# EAGLE design Yayın Ders 2 (EAGLE 9.6.2)
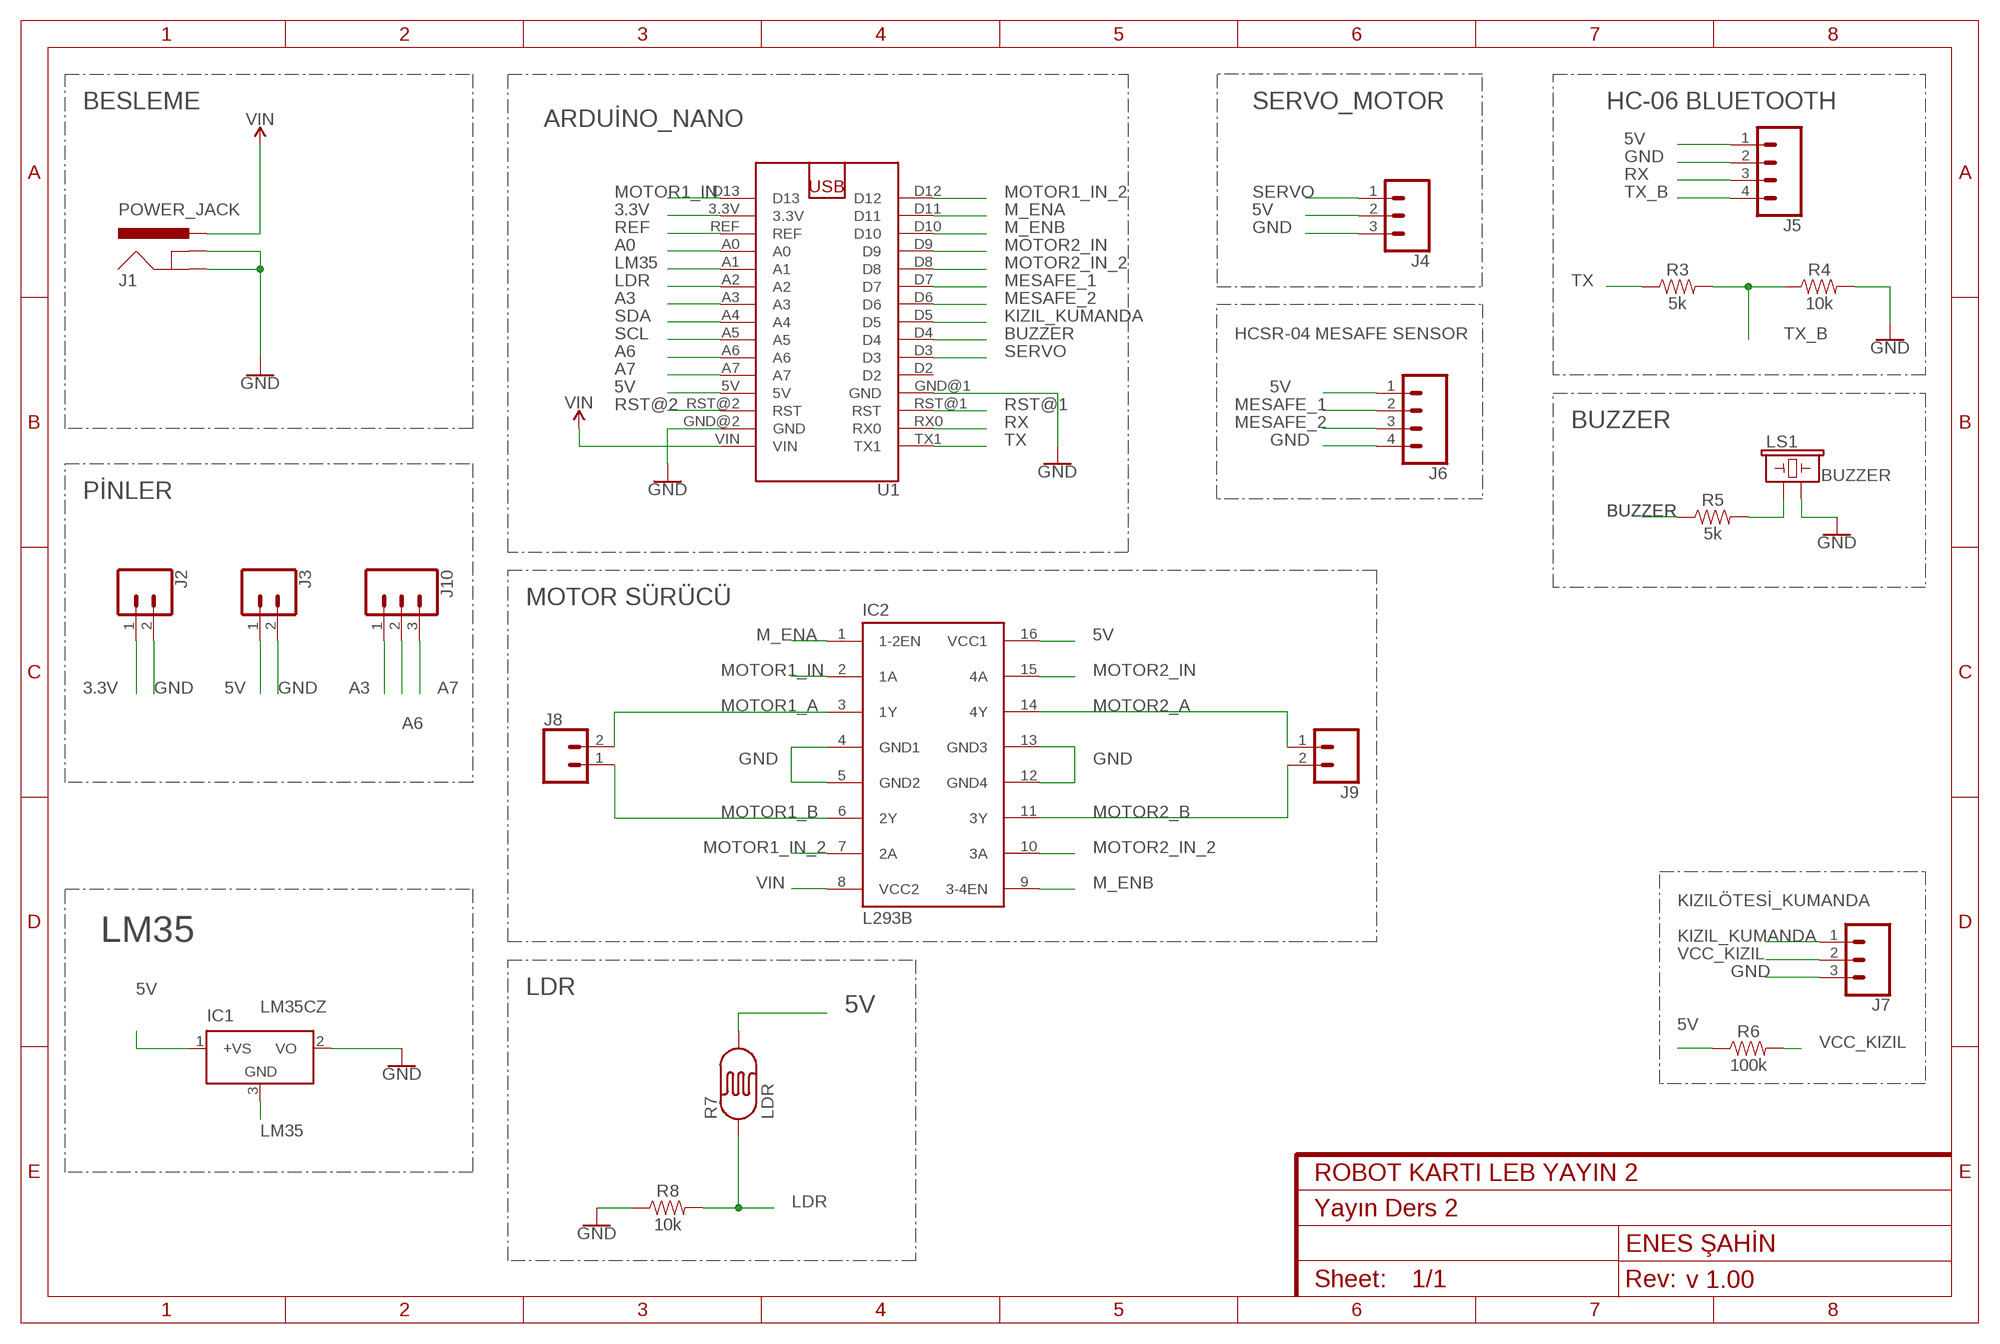
[diagram p0: schematic, sheet 1]
FRAME1 (FRAME-A4L): CNAME: ROBOT KARTI LEB YAYIN 2; CREVISION: v 1.00; DESIGNER: ENES ŞAHİN

## Parts
IC1  LM35CZ  [TO92]
IC2  L293B  L293D  [DIL16]
J1  POWER_JACK  [POWER_JACK_PTH]
J2  CONN_02  [1X02]
J3  CONN_02  [1X02]
J4  CONN_03  [1X03]
J5  CONN_04  [1X04]
J6  CONN_04  [1X04]
J7  CONN_03  [1X03]
J8  CONN_02  [1X02]
J9  CONN_02  [1X02]
J10  CONN_03  [1X03]
LS1  BUZZER  BUZZER-PTH  [BUZZER-12MM]
R3  5k  1KOHM-HORIZ-1/4W-1%  [AXIAL-0.3]
R4  10k  1KOHM-HORIZ-1/4W-1%  [AXIAL-0.3]
R5  5k  1KOHM-HORIZ-1/4W-1%  [AXIAL-0.3]
R6  100k  1KOHM-HORIZ-1/4W-1%  [AXIAL-0.3]
R7  LDR  PHOTOCELLPTH  [PHOTOCELL]
R8  10k  1KOHM-HORIZ-1/4W-1%  [AXIAL-0.3]
U1  ARDUINO_NANO  [ARDUINO_NANO]

## Nets
3.3V: J2.1 U1.3.3V
5V: IC1.1(+VS) IC2.16(VCC1) J3.1 J4.2 J5.1 J6.1 R6.P$1 R7.2 U1.5V
A0: U1.A0
A3: J10.1 U1.A3
A6: J10.2 U1.A6
A7: J10.3 U1.A7
BUZZER: R5.P$1 U1.D4
GND: IC1.2(VO) IC2.4(GND1) IC2.5(GND2) IC2.12(GND4) IC2.13(GND3) J1.GND J1.GNDBREAK J2.2 J3.2 J4.3 J5.2 J6.4 J7.3 LS1.- R4.P$2 R8.P$1 U1.GND@1(GND) U1.GND@2(GND)
KIZIL_KUMANDA: J7.1 U1.D5
LDR: R7.1 R8.P$2 U1.A2
LM35: IC1.3(GND) U1.A1
M_ENA: IC2.1(1-2EN) U1.D11
M_ENB: IC2.9(3-4EN) U1.D10
MESAFE_1: J6.2 U1.D7
MESAFE_2: J6.3 U1.D6
MOTOR1_A: IC2.3(1Y) J8.2
MOTOR1_B: IC2.6(2Y) J8.1
MOTOR1_IN: IC2.2(1A) U1.D13
MOTOR1_IN_2: IC2.7(2A) U1.D12
MOTOR2_A: IC2.14(4Y) J9.1
MOTOR2_B: IC2.11(3Y) J9.2
MOTOR2_IN: IC2.15(4A) U1.D9
MOTOR2_IN_2: IC2.10(3A) U1.D8
N$1: LS1.+ R5.P$2
REF: U1.REF
RST@1: U1.RST@1(RST)
RST@2: U1.RST@2(RST)
RX: J5.3 U1.RX0
SCL: U1.A5
SDA: U1.A4
SERVO: J4.1 U1.D3
TX: R3.P$1 U1.TX1
TX_B: J5.4 R3.P$2 R4.P$1
VCC_KIZIL: J7.2 R6.P$2
VIN: IC2.8(VCC2) J1.PWR U1.VIN
Unconnected: U1.D2

## Notes on the sheet
- BESLEME | SERVO_MOTOR | HC-06 BLUETOOTH
- ARDUİNO_NANO
- HCSR-04 MESAFE SENSOR
- BUZZER
- PİNLER
- MOTOR SÜRÜCÜ
- KIZILÖTESİ_KUMANDA
- LM35
- LDR

## Library data of the parts
IC1 = lm35:LM35: Single-Supply Centigrade Temperature Sensor Vout = (10mV/°C x Temp °C) +5mmmV Source: http://www.national.com/ds/LM/LM35.pdf
IC2 = st-microelectronics:L293D: PUSH-PULL 4 CHANNEL DRIVER; MPN: L293D; OC_FARNELL: 9589619; OC_NEWARK: 56P8249
J1 = SparkFun-Connectors:POWER_JACK: Power Jack Connector This is the standard 5.5mm barrel jack for power. The PTH is the most common, proven, reliable, footprint. The Slot footprint only works if the mill layer is transmitted to the PCB fab house so be warned. Here are the connectors we sell at SparkFun: DC Barrel Power Jack/Connector <https://www.sparkfun.com/products/119> (PRT-00119) DC Barrel Power Jack/Connector (SMD) <https://www.sparkfun.com/products/12748> (PRT-12748) DC Barrel Jack Adapter - Breadboard Compatible <https://www.sparkfun.com/products/10811> (PRT-10811) It is used on this SparkFun product (and many, many others): SparkFun RedBoard - Programmed with Arduino <https://www.sparkfun.com/products/12757> (DEV-12757) Also, if you need a mating power supply or connector, please check these out: Wall Adapter Power Supply - 9VDC 650mA <https://www.sparkfun.com/products/298> (TOL-00298) DC Barrel Jack Adapter - Male <https://www.sparkfun.com/products/10287> (PRT-10287); PROD_ID: CONN-08197
J2 J3 J8 J9 = SparkFun-Connectors:CONN_02: Multi connection point. Often used as Generic Header-pin footprint for 0.1 inch spaced/style header connections On any of the 0.1 inch spaced packages, you can populate with these: Break Away Headers - Straight <https://www.sparkfun.com/products/116> (PRT-00116) Break Away Male Headers - Right Angle <https://www.sparkfun.com/products/553> (PRT-00553) Female Headers <https://www.sparkfun.com/products/115> (PRT-00115) Break Away Headers - Machine Pin <https://www.sparkfun.com/products/117> (PRT-00117) Break Away Female Headers - Swiss Machine Pin <https://www.sparkfun.com/products/743> (PRT-00743) For SCREWTERMINALS and SPRING TERMINALS visit here: Screw Terimnals on SparkFun.com <https://www.sparkfun.com/search/results?term=Screw+Terminals> (5mm/3.5mm/2.54mm spacing) This device is also useful as a general connection point to wire up your design to another part of your project. Our various solder wires solder well into these plated through hole pads. Hook-Up Wire - Assortment (Stranded, 22 AWG) <https://www.sparkfun.com/products/11375> (PRT-11375) Hook-Up Wire - Assortment (Solid Core, 22 AWG) <https://www.sparkfun.com/products/11367> (PRT-11367) View the entire wire category on our website here <https://www.sparkfun.com/categories/141> Special notes: Molex polarized connector foot print use with: PRT-08233 with associated crimp pins and housings. 2.54_SCREWTERM for use with PRT-10571. 3.5mm Screw Terminal footprints for PRT-08084 5mm Screw Terminal footprints for use with PRT-08432
J4 J7 J10 = SparkFun-Connectors:CONN_03: Multi connection point. Often used as Generic Header-pin footprint for 0.1 inch spaced/style header connections On any of the 0.1 inch spaced packages, you can populate with these: Break Away Headers - Straight <https://www.sparkfun.com/products/116> (PRT-00116) Break Away Male Headers - Right Angle <https://www.sparkfun.com/products/553> (PRT-00553) Female Headers <https://www.sparkfun.com/products/115> (PRT-00115) Break Away Headers - Machine Pin <https://www.sparkfun.com/products/117> (PRT-00117) Break Away Female Headers - Swiss Machine Pin <https://www.sparkfun.com/products/743> (PRT-00743) Stackable Header - 3 Pin (Female, 0.1") <https://www.sparkfun.com/products/13875> (PRT-13875) For SCREWTERMINALS and SPRING TERMINALS visit here: Screw Terimnals on SparkFun.com <https://www.sparkfun.com/search/results?term=Screw+Terminals> (5mm/3.5mm/2.54mm spacing) This device is also useful as a general connection point to wire up your design to another part of your project. Our various solder wires solder well into these plated through hole pads. Hook-Up Wire - Assortment (Stranded, 22 AWG) <https://www.sparkfun.com/products/11375> (PRT-11375) Hook-Up Wire - Assortment (Solid Core, 22 AWG) <https://www.sparkfun.com/products/11367> (PRT-11367) View the entire wire category on our website here <https://www.sparkfun.com/categories/141> Special notes: Molex polarized connector foot print use with SKU : PRT-08232 with associated crimp pins and housings.
J5 J6 = SparkFun-Connectors:CONN_04: Multi connection point. Often used as Generic Header-pin footprint for 0.1 inch spaced/style header connections On any of the 0.1 inch spaced packages, you can populate with these: Break Away Headers - Straight <https://www.sparkfun.com/products/116> (PRT-00116) Break Away Male Headers - Right Angle <https://www.sparkfun.com/products/553> (PRT-00553) Female Headers <https://www.sparkfun.com/products/115> (PRT-00115) Break Away Headers - Machine Pin <https://www.sparkfun.com/products/117> (PRT-00117) Break Away Female Headers - Swiss Machine Pin <https://www.sparkfun.com/products/743> (PRT-00743) For SCREWTERMINALS and SPRING TERMINALS visit here: Screw Terimnals on SparkFun.com <https://www.sparkfun.com/search/results?term=Screw+Terminals> (5mm/3.5mm/2.54mm spacing) This device is also useful as a general connection point to wire up your design to another part of your project. Our various solder wires solder well into these plated through hole pads. Hook-Up Wire - Assortment (Stranded, 22 AWG) <https://www.sparkfun.com/products/11375> (PRT-11375) Hook-Up Wire - Assortment (Solid Core, 22 AWG) <https://www.sparkfun.com/products/11367> (PRT-11367) View the entire wire category on our website here <https://www.sparkfun.com/categories/141> Special notes: Molex polarized connector foot print use with SKU : PRT-08231 with associated crimp pins and housings. 1MM SMD Version SKU: PRT-10208; PROD_ID: CONN-09696
LS1 = SparkFun-Electromechanical:BUZZER: Buzzer Small round buzzers that operate around the audible 2kHz range. You can use these as speakers to create simple music or user interfaces. Variant Overview: PTH - Mini Speaker - PC Mount 12mm 2.048kHz <https://www.sparkfun.com/products/7950> PTH_KIT - Mini Speaker - PC Mount 12mm 2.048kHz <https://www.sparkfun.com/products/7950> KIT simplifies soldering by adding stop mask to one side of the pads. PTH_NO_SILK - Mini Speaker - PC Mount 12mm 2.048kHz <https://www.sparkfun.com/products/7950> No silkscreen indicator of buzzer outline. PTH_KIT_NO_SILK - Mini Speaker - PC Mount 12mm 2.048kHz <https://www.sparkfun.com/products/7950> KIT package w/o silkscreen SMD - Buzzer Audio Magnetic (CCV-084B16) SMD buzzer used on, e.g. the LilyPad Buzzer <https://www.sparkfun.com/products/8463> and RFID USB Reader <https://www.sparkfun.com/products/9963>. SMD_KIT - Buzzer Audio Magnetic (CCV-084B16) SMD Buzzer with elongated pins to make soldering easier. Used on the SparkFun Simon Says - Surface Mount Soldering Kit <https://www.sparkfun.com/products/10935>.; PROD_ID: COMP-08253; SF_SKU: COM-07950
R3-R5 = SparkFun-Resistors:1KOHM: 1kΩ resistor A resistor is a passive two-terminal electrical component that implements electrical resistance as a circuit element. Resistors act to reduce current flow, and, at the same time, act to lower voltage levels within circuits. - Wikipedia; PROD_ID: RES-12182; VALUE: 1k
R6 R8 = SparkFun-Resistors1:1KOHM: 1kΩ resistor A resistor is a passive two-terminal electrical component that implements electrical resistance as a circuit element. Resistors act to reduce current flow, and, at the same time, act to lower voltage levels within circuits. - Wikipedia; PROD_ID: RES-12182; VALUE: 1k
R7 = SparkFun:PHOTOCELL: Photocell Also known as a CdS photoresistor. This is a low cost way to detect light levels. Resistance decreases with more incoming light. SparkFun SKU: SEN-09088
U1 = LezzetliRobotTrifleri:ARDUINO_NANO: ARDUİNO NANO DEVİCE

## Board
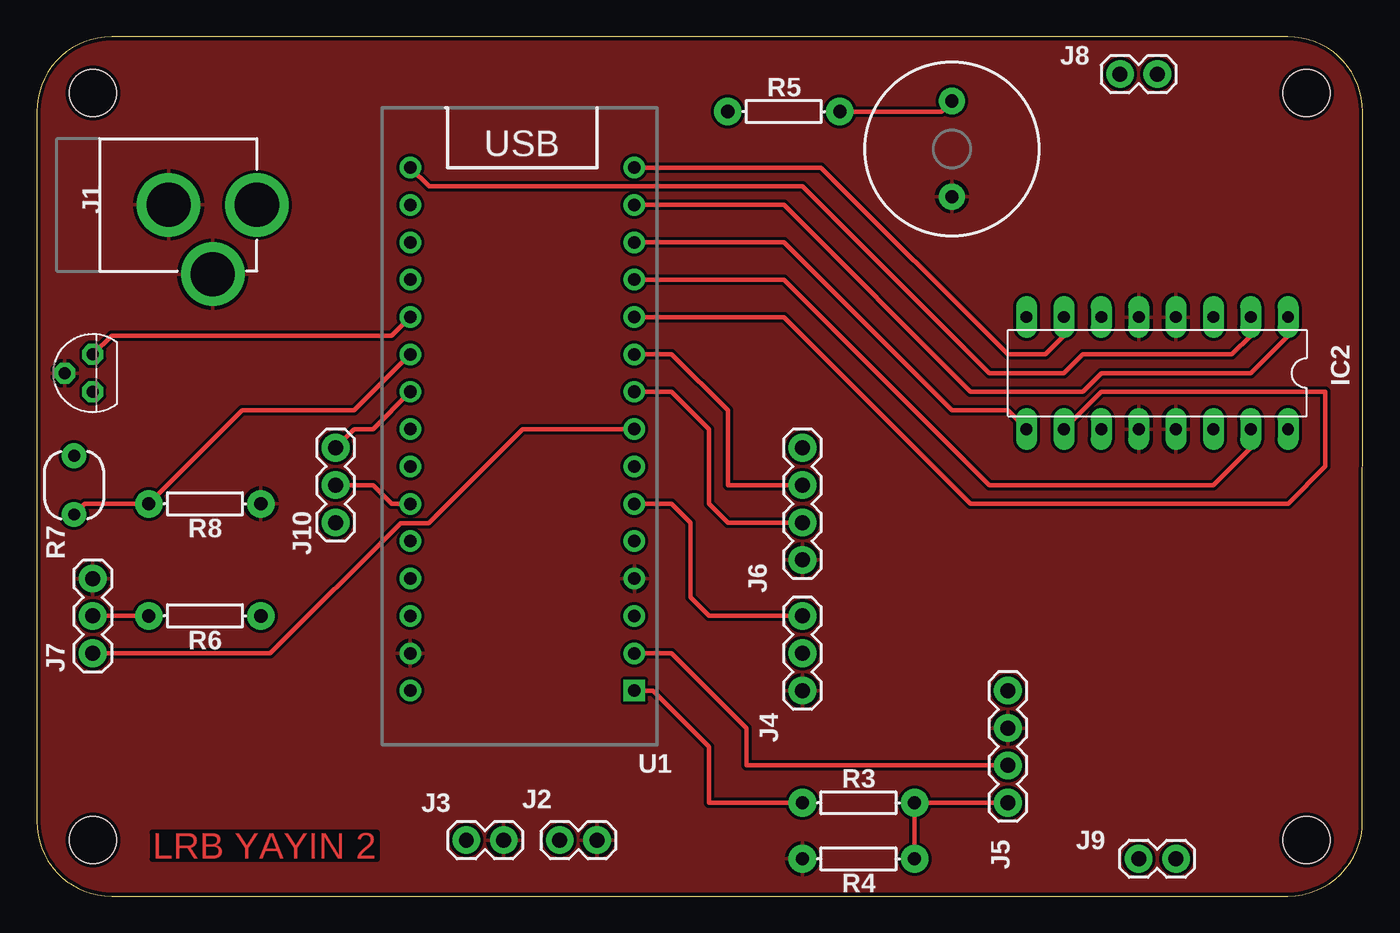
[diagram p1: board, top side]
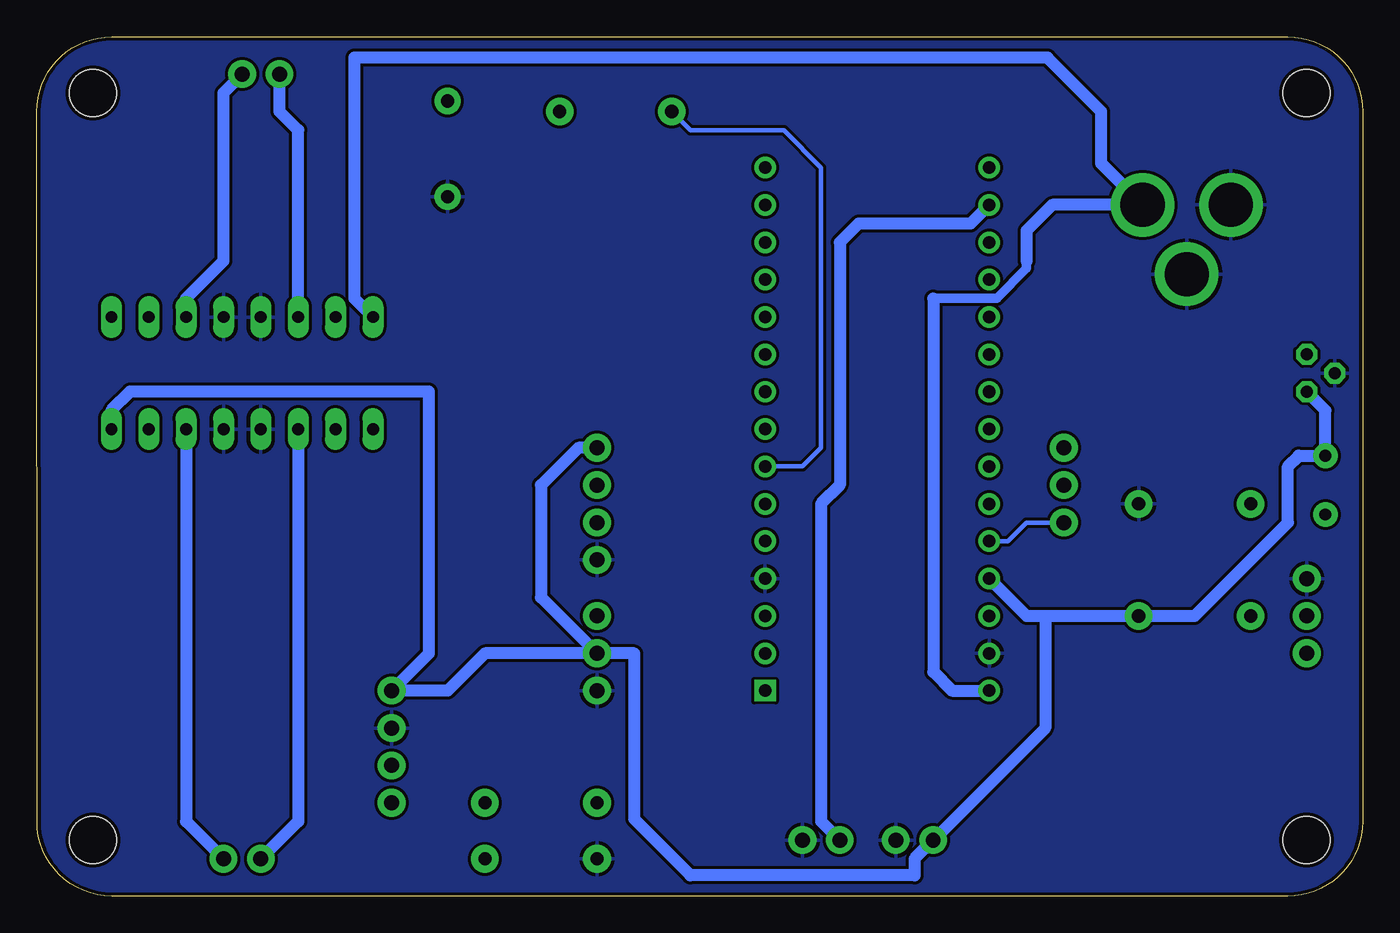
[diagram p2: board, bottom side, seen from below]

Size 90.17 x 58.42 mm. Coordinates in mm from the lower left corner, seen from the top.
Outline: 0,53.34 0,5.08 arc90 5.08,0 85.07,0 arc90 90.15,5.08 90.17,53.34 arc90 85.09,58.42 5.08,58.42 arc90 0,53.34
Copper layers (1*16): Top 0.035mm / dielectric 1.5mm / Bottom 0.035mm
Design rules "SparkFun": minimum track width 8mil, minimum drill 20mil, track to track 8mil, track to pad 8mil, pad to pad 8mil, via to via 8mil, smd to smd 8mil, copper to edge 10mil, drill to drill 8mil, minimum pad ring 12mil, minimum via ring 10mil, stop-mask expansion 4mil, vias tented up to drill 25mil, thermal gap 10mil
Holes 3.2 mm at 3.81,54.61 86.36,54.61 86.36,3.81 3.81,3.81

### Footprints (pad centres in the part's own frame; a part is rotated, then mirrored left to right if it is on the bottom)
TO92 = drill 0.813 octagon: 1 -1.27,0; 2 0,1.905; 3 1.27,0
DIL16 = drill 0.813 long: 1 -8.89,-3.81; 2 -6.35,-3.81; 3 -3.81,-3.81; 4 -1.27,-3.81; 5 1.27,-3.81; 6 3.81,-3.81; 7 6.35,-3.81; 8 8.89,-3.81; 9 8.89,3.81; 10 6.35,3.81; 11 3.81,3.81; 12 1.27,3.81; 13 -1.27,3.81; 14 -3.81,3.81; 15 -6.35,3.81; 16 -8.89,3.81
POWER_JACK_PTH = drill 2.997 pad 4.318: GND 0,7.7; GNDBREAK 4.7,10.7; PWR 0,13.7
1X02 = drill 1.016 pad 1.88: 1 0,0; 2 2.54,0
1X03 = drill 1.016 pad 1.88: 1 0,0; 2 2.54,0; 3 5.08,0
1X04 = drill 1.016 pad 1.88: 1 0,0; 2 2.54,0; 3 5.08,0; 4 7.62,0
BUZZER-12MM = drill 0.9 pad 1.778: + 3.25,0; - -3.25,0
AXIAL-0.3 = drill 0.9 pad 1.88: P$1 -3.81,0; P$2 3.81,0
PHOTOCELL = drill 0.8 pad 1.676: 1 -2,0; 2 2,0
ARDUINO_NANO = drill 0.85: 3.3V 15.24,2.54; 5V 15.24,27.94; A0 15.24,7.62; A1 15.24,10.16; A2 15.24,12.7; A3 15.24,15.24; A4 15.24,17.78; A5 15.24,20.32; A6 15.24,22.86; A7 15.24,25.4; D2 0,25.4; D3 0,22.86; D4 0,20.32; D5 0,17.78; D6 0,15.24; D7 0,12.7; D8 0,10.16; D9 0,7.62; D10 0,5.08; D11 0,2.54; D12 0,0; D13 15.24,0; GND@1 0,27.94; GND@2 15.24,33.02; REF 15.24,5.08; RST@1 0,30.48; RST@2 15.24,30.48; RX0 0,33.02; VIN 15.24,35.56 | drill 0.85 square: TX1 0,35.56

### Placement (x,y rotation side)
IC1  3.81,35.56 90 top
IC2  76.2,35.56 180 top
J1  1.27,46.99 270 top
J2  35.56,3.81 0 top
J3  29.21,3.81 0 top
J4  52.07,19.05 270 top
J5  66.04,13.97 270 top
J6  52.07,30.48 270 top
J7  3.81,16.51 90 top
J8  73.66,55.88 0 top
J9  77.47,2.54 180 top
J10  20.32,30.48 270 top
LS1  62.23,50.8 90 top
R3  55.88,6.35 0 top
R4  55.88,2.54 180 top
R5  50.8,53.34 0 top
R6  11.43,19.05 180 top
R7  2.54,27.94 90 top
R8  11.43,26.67 180 top
U1  40.64,49.53 180 top

### Tracks (layer width: path | path; a pad name or v marks a point on that pad's centre or on a via)
3.3V
  Bottom 0.813: U1.3.3V 26.67,45.72 34.29,45.72 35.56,44.45 35.56,27.94 36.83,26.67 36.83,5.08 J2.1
5V
  Bottom 0.813: J4.2 49.53,16.51 49.53,5.23 45.72,1.42 30.48,1.42 30.48,2.54 J3.1 21.59,11.43 21.59,19.05 | J4.2 59.69,16.51 62.23,13.97 J5.1 63.5,16.51 63.5,34.29 83.82,34.29 85.09,33.02 IC2.16 | J6.1 53.34,30.48 55.88,27.94 55.88,20.32 J4.2 | U1.5V 22.86,19.05 21.59,19.05 | 21.59,19.05 R6.P$1 11.43,19.05 5.08,25.4 5.08,29.21 4.35,29.94 R7.2 2.54,33.02 IC1.1
A3
  Top 0.305: U1.A3 22.86,31.75 21.59,31.75 J10.1
A6
  Top 0.305: U1.A6 24.13,26.67 22.86,27.94 J10.2
A7
  Bottom 0.305: U1.A7 24.13,24.13 22.86,25.4 J10.3
BUZZER
  Bottom 0.305: R5.P$1 45.72,52.07 39.37,52.07 36.83,49.53 36.83,30.48 38.1,29.21 U1.D4
GND
  pour Top: -1.27,59.69 91.44,59.69 91.44,-1.27 -1.27,-1.27
  pour Bottom: -2.54,60.96 92.71,60.96 92.71,-2.54 -2.54,-2.54
KIZIL_KUMANDA
  Top 0.305: U1.D5 33.02,31.75 26.64,25.37 24.74,25.37 15.88,16.51 J7.1
LDR
  Top 0.305: R7.1 3.27,26.67 R8.P$2 13.97,33.02 21.59,33.02 U1.A2
LM35
  Top 0.305: IC1.3 5.08,38.1 24.13,38.1 U1.A1
M_ENA
  Top 0.305: IC2.1 85.09,38.1 82.55,35.56 72.39,35.56 71.12,34.29 63.5,34.29 50.8,46.99 U1.D11
M_ENB
  Top 0.305: IC2.9 66.04,33.02 62.23,33.02 50.8,44.45 U1.D10
MESAFE_1
  Top 0.305: U1.D7 43.18,36.83 46.99,33.02 46.99,27.94 J6.2
MESAFE_2
  Top 0.305: U1.D6 43.18,34.29 45.72,31.75 45.72,26.67 46.99,25.4 J6.3
MOTOR1_A
  Bottom 0.813: IC2.3 80.01,40.64 77.47,43.18 77.47,54.61 J8.2
MOTOR1_B
  Bottom 0.813: IC2.6 72.39,52.07 73.66,53.34 J8.1
MOTOR1_IN
  Top 0.305: IC2.2 82.55,38.1 81.28,36.83 71.12,36.83 69.85,35.56 64.77,35.56 52.07,48.26 26.67,48.26 U1.D13
MOTOR1_IN_2
  Top 0.305: IC2.7 69.85,38.1 68.58,36.83 66.04,36.83 53.34,49.53 U1.D12
MOTOR2_A
  Bottom 0.813: IC2.14 80.01,5.08 J9.1
MOTOR2_B
  Bottom 0.813: IC2.11 72.39,5.08 J9.2
MOTOR2_IN
  Top 0.305: IC2.15 82.55,30.48 80.01,27.94 64.77,27.94 50.8,41.91 U1.D9
MOTOR2_IN_2
  Top 0.305: IC2.10 72.39,34.29 87.63,34.29 87.63,29.21 85.09,26.67 63.5,26.67 50.8,39.37 U1.D8
N$1
  Top 0.305: LS1.+ 61.52,53.34 R5.P$2
RX
  Top 0.305: U1.RX0 43.18,16.51 48.26,11.43 48.26,8.89 J5.3
SERVO
  Top 0.305: U1.D3 43.18,26.67 44.45,25.4 44.45,20.32 45.72,19.05 J4.1
TX
  Top 0.305: U1.TX1 41.91,13.97 45.72,10.16 45.72,6.35 R3.P$1
TX_B
  Top 0.305: J5.4 R3.P$2 R4.P$1
VCC_KIZIL
  Top 0.305: J7.2 R6.P$2
VIN
  Bottom 0.635: 22.86,43.18 22.86,42.68 24.88,40.66 25.38,40.66 25.4,40.64 29.21,40.64
  Bottom 0.813: IC2.8 68.58,40.64 68.58,57 21.44,57 17.78,53.34 17.78,49.8 J1.PWR 21.11,46.99 22.86,45.24 22.86,43.18 | 29.21,40.64 29.21,15.24 27.94,13.97 U1.VIN

### Text on the board
Top: LRB YAYIN 2
tStop: LRB YAYIN 2